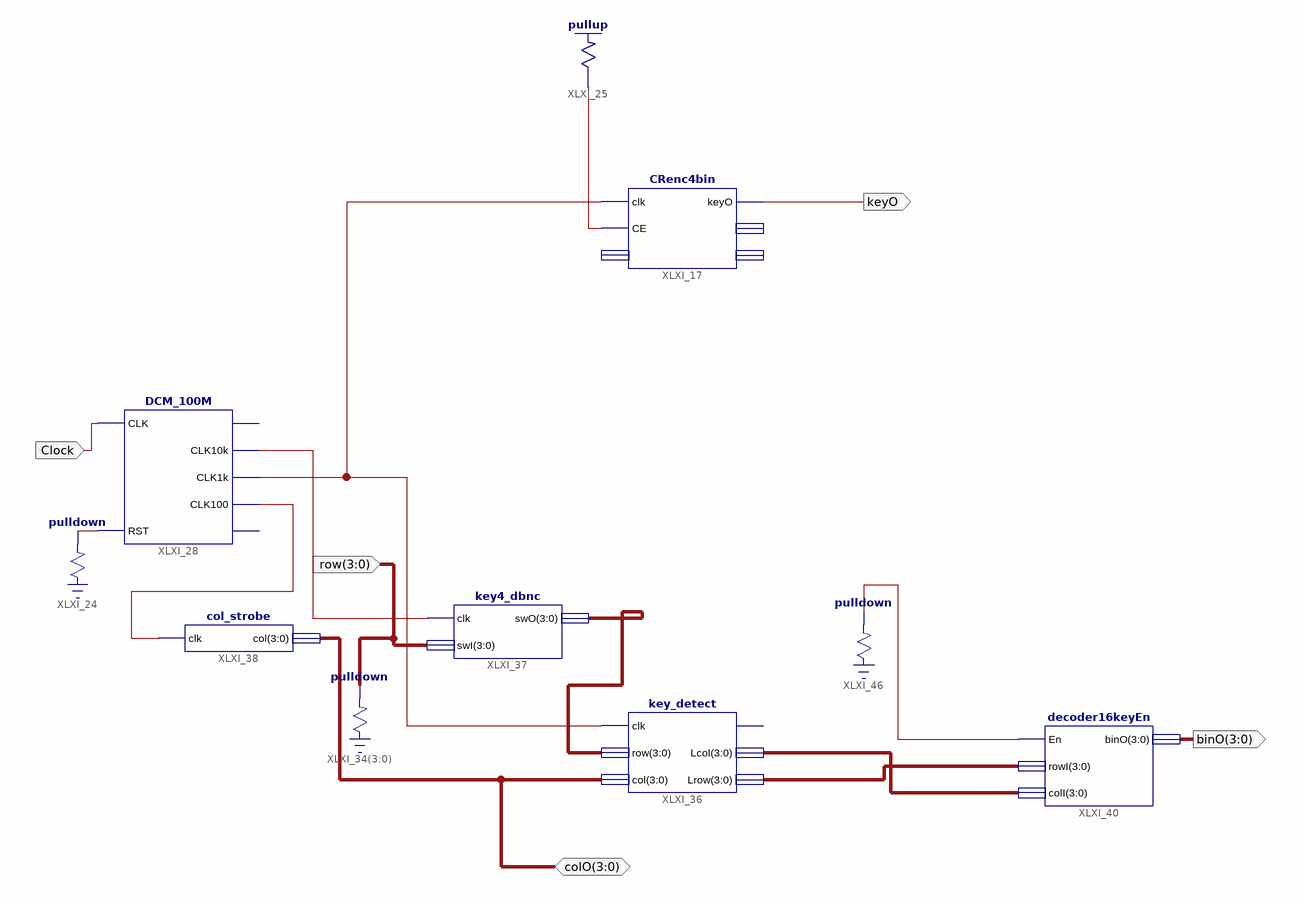
[diagram p0: schematic sheet 1]
// Xilinx ISE schematic lab_KEYPAD_FINAL.sch (spartan3e) as structural Verilog: 10 symbols, 5 ports
module lab_KEYPAD_FINAL (
  input  Clock,
  input  [3:0] row,
  inout  [3:0] colO,
  output keyO,
  output [3:0] binO
);

  wire XLXN_43, XLXN_44, XLXN_57, XLXN_58, XLXN_61, XLXN_67;
  wire [3:0] XLXN_62, XLXN_65, XLXN_66;

  \pulldown  XLXI_24 (.O(XLXN_43));
  DCM_100M XLXI_28 (
    .CLK(Clock), .RST(XLXN_43), .CLK10k(XLXN_61), .CLK1k(XLXN_57), .CLK100(XLXN_58));  // open: CLK1M, CLK1
  \pullup  XLXI_25 (.O(XLXN_44));
  CRenc4bin XLXI_17 (.clk(XLXN_57), .CE(XLXN_44), .keyO(keyO));  // open: rowI, binO, colO
  col_strobe XLXI_38 (.clk(XLXN_58), .col(colO));
  decoder16keyEn XLXI_40 (.En(XLXN_67), .rowI(XLXN_66), .colI(XLXN_65), .binO(binO));
  key4_dbnc XLXI_37 (.clk(XLXN_61), .swI(row), .swO(XLXN_62));
  key_detect XLXI_36 (.clk(XLXN_57), .row(XLXN_62), .col(colO), .Lcol(XLXN_65), .Lrow(XLXN_66));  // open: keyL
  \pulldown  XLXI_34[3:0] (.O(row));
  \pulldown  XLXI_46 (.O(XLXN_67));
endmodule
